# Altium schematic sheet APM9328_TOP.SchDoc: TOP
size A4; Author: NC; Revision: 1.0; SheetNumber: 1; SheetTotal: 1
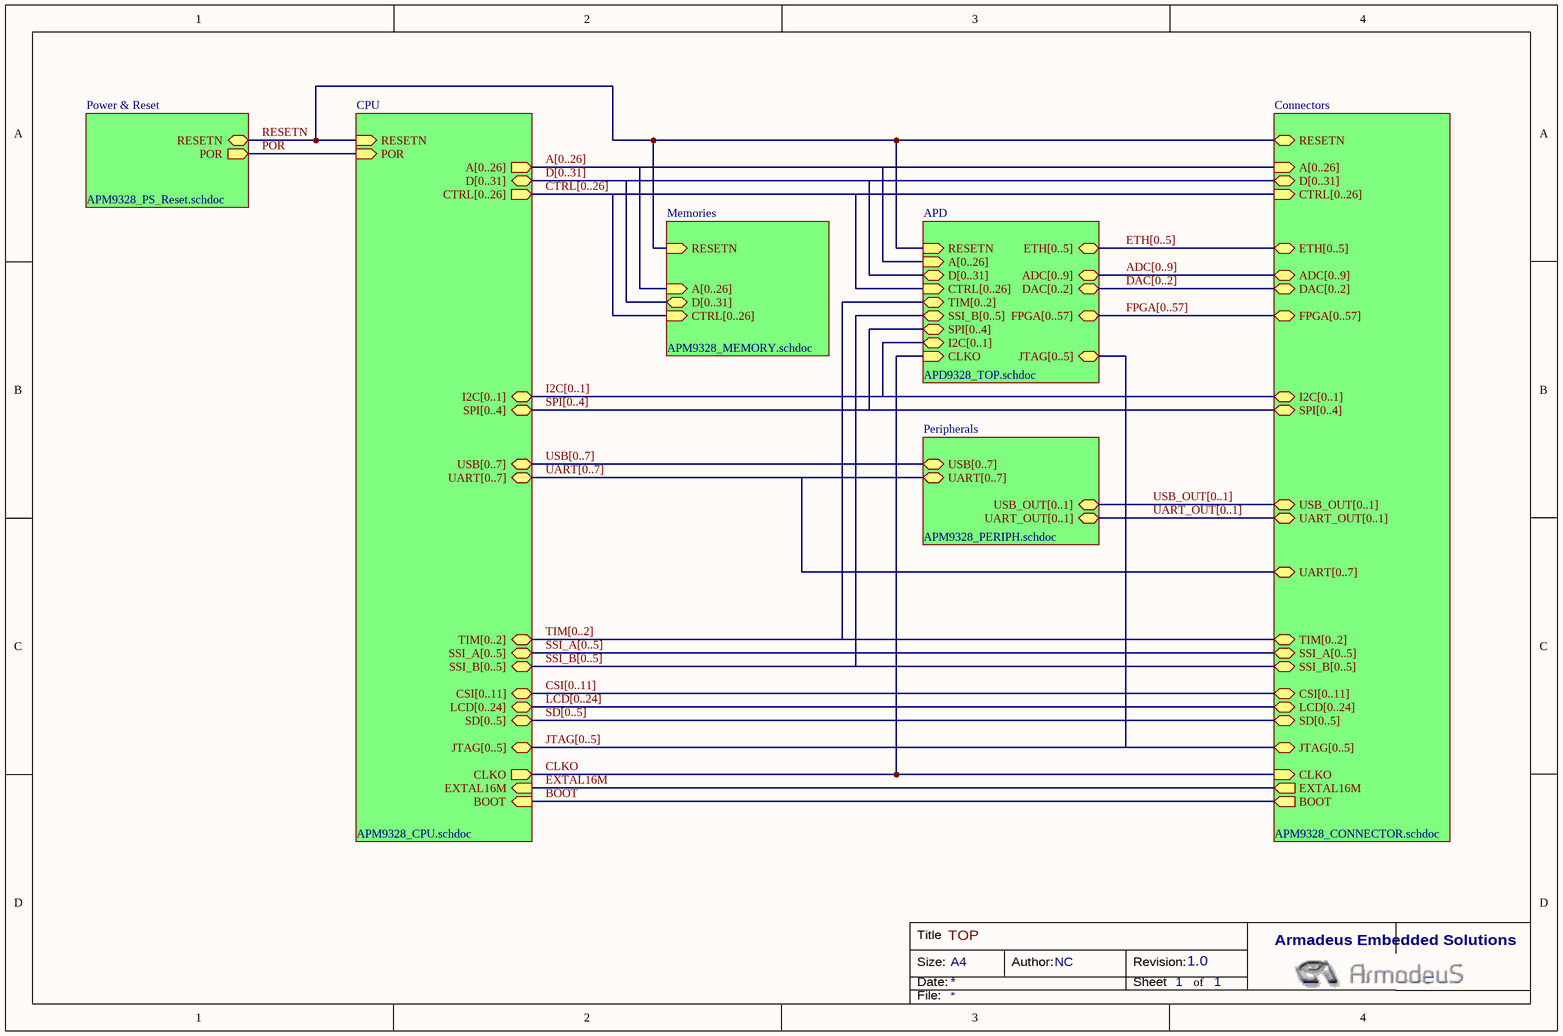
[diagram p0: APM9328_TOP.SchDoc]

## Sub-sheets
APD = APD9328_TOP.schdoc: RESETN (in), A[0..26] (in), D[0..31] (bidir), CTRL[0..26] (in), ETH[0..5] (bidir), ADC[0..9] (bidir), DAC[0..2] (bidir), FPGA[0..57] (bidir), I2C[0..1] (bidir), SPI[0..4] (bidir), CLKO (in), SSI_B[0..5] (bidir), TIM[0..2] (bidir), JTAG[0..5] (bidir)
Connectors = APM9328_CONNECTOR.schdoc: UART[0..7] (bidir), UART_OUT[0..1] (bidir), USB_OUT[0..1] (bidir), A[0..26] (in), D[0..31] (bidir), CTRL[0..26] (in), TIM[0..2] (bidir), I2C[0..1] (bidir), SPI[0..4] (bidir), SSI_A[0..5] (bidir), SSI_B[0..5] (bidir), CSI[0..11] (bidir), LCD[0..24] (bidir), SD[0..5] (bidir), JTAG[0..5] (bidir), CLKO (in), EXTAL16M (out), BOOT (out), RESETN (bidir), ETH[0..5] (bidir), ADC[0..9] (bidir), DAC[0..2] (bidir), FPGA[0..57] (bidir)
CPU = APM9328_CPU.schdoc: A[0..26] (out), BOOT (in), CLKO (out), CSI[0..11] (bidir), CTRL[0..26] (out), D[0..31] (bidir), EXTAL16M (in), I2C[0..1] (bidir), JTAG[0..5] (bidir), LCD[0..24] (bidir), RESETN (in), POR (in), SD[0..5] (bidir), SPI[0..4] (bidir), SSI_A[0..5] (bidir), SSI_B[0..5] (bidir), TIM[0..2] (bidir), UART[0..7] (bidir), USB[0..7] (bidir)
Memories = APM9328_MEMORY.schdoc: A[0..26] (in), CTRL[0..26] (in), D[0..31] (bidir), RESETN (in)
Peripherals = APM9328_PERIPH.schdoc: UART[0..7] (bidir), UART_OUT[0..1] (bidir), USB[0..7] (bidir), USB_OUT[0..1] (bidir)
Power & Reset = APM9328_PS_Reset.schdoc: POR (out), RESETN (bidir)

## Nets
BOOT: sheet CPU/BOOT, sheet Connectors/BOOT
CLKO: sheet CPU/CLKO, sheet Connectors/CLKO, sheet APD/CLKO
EXTAL16M: sheet CPU/EXTAL16M, sheet Connectors/EXTAL16M
POR: sheet Power & Reset/POR, sheet CPU/POR
RESETN: sheet Power & Reset/RESETN, sheet CPU/RESETN, sheet Memories/RESETN, sheet Connectors/RESETN, sheet APD/RESETN

## Buses and harness runs
bus A[0..26] = sheet APD/A[0..26] = sheet Connectors/A[0..26] = sheet CPU/A[0..26] = sheet Memories/A[0..26]
bus ADC[0..9] = sheet APD/ADC[0..9] = sheet Connectors/ADC[0..9]
bus CSI[0..11] = sheet Connectors/CSI[0..11] = sheet CPU/CSI[0..11]
bus CTRL[0..26] = sheet APD/CTRL[0..26] = sheet Connectors/CTRL[0..26] = sheet CPU/CTRL[0..26] = sheet Memories/CTRL[0..26]
bus D[0..31] = sheet APD/D[0..31] = sheet Connectors/D[0..31] = sheet CPU/D[0..31] = sheet Memories/D[0..31]
bus DAC[0..2] = sheet APD/DAC[0..2] = sheet Connectors/DAC[0..2]
bus ETH[0..5] = sheet APD/ETH[0..5] = sheet Connectors/ETH[0..5]
bus FPGA[0..57] = sheet APD/FPGA[0..57] = sheet Connectors/FPGA[0..57]
bus I2C[0..1] = sheet APD/I2C[0..1] = sheet Connectors/I2C[0..1] = sheet CPU/I2C[0..1]
bus JTAG[0..5] = sheet APD/JTAG[0..5] = sheet Connectors/JTAG[0..5] = sheet CPU/JTAG[0..5]
bus LCD[0..24] = sheet Connectors/LCD[0..24] = sheet CPU/LCD[0..24]
bus SD[0..5] = sheet Connectors/SD[0..5] = sheet CPU/SD[0..5]
bus SPI[0..4] = sheet APD/SPI[0..4] = sheet Connectors/SPI[0..4] = sheet CPU/SPI[0..4]
bus SSI_A[0..5] = sheet Connectors/SSI_A[0..5] = sheet CPU/SSI_A[0..5]
bus SSI_B[0..5] = sheet APD/SSI_B[0..5] = sheet Connectors/SSI_B[0..5] = sheet CPU/SSI_B[0..5]
bus TIM[0..2] = sheet APD/TIM[0..2] = sheet Connectors/TIM[0..2] = sheet CPU/TIM[0..2]
bus UART[0..7] = sheet Connectors/UART[0..7] = sheet CPU/UART[0..7] = sheet Peripherals/UART[0..7]
bus UART_OUT[0..1] = sheet Connectors/UART_OUT[0..1] = sheet Peripherals/UART_OUT[0..1]
bus USB[0..7] = sheet CPU/USB[0..7] = sheet Peripherals/USB[0..7]
bus USB_OUT[0..1] = sheet Connectors/USB_OUT[0..1] = sheet Peripherals/USB_OUT[0..1]

## Notes on the sheet
- Title
- Size:
- Date:
- A4
- Author:
- Revision:
- Sheet
- of
- Armadeus Embedded Solutions
- File: